# Altium schematic sheet Sd_sdio.SchDoc
size A4
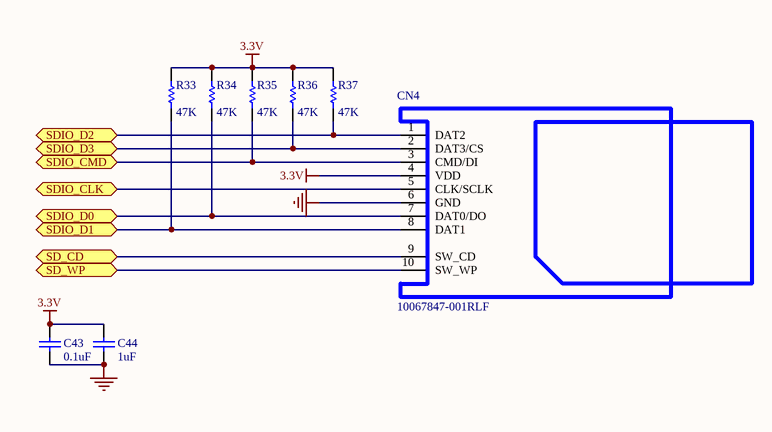
[diagram p0: Sd_sdio.SchDoc]

## Parts
C43  value 0.1uF  [CAPC2012N]  (hidden comment: Cap)
C44  value 1uF  [CAPC3216N]  (hidden comment: Cap)
CN4  10067847-001RLF  [10067847]
R33  value 47K  [RESC2012N]  (hidden comment: 1206)
R34  value 47K  [RESC2012N]  (hidden comment: 1206)
R35  value 47K  [RESC2012N]  (hidden comment: 1206)
R36  value 47K  [RESC2012N]  (hidden comment: 1206)
R37  value 47K  [RESC2012N]  (hidden comment: 1206)

## Ports
SD_CD (bidir), SD_WP (bidir), SDIO_CLK (bidir), SDIO_CMD (bidir), SDIO_D0 (bidir), SDIO_D1 (bidir), SDIO_D2 (bidir), SDIO_D3 (bidir)

## Nets
3.3V: C43.2 C44.2 CN4.4(VDD) R33.2 R34.2 R35.2 R36.2 R37.2
DGND: C43.1 C44.1 CN4.6(GND)
SD_CD: CN4.9(SW_CD) ; port SD_CD
SD_WP: CN4.10(SW_WP) ; port SD_WP
SDIO_CLK: CN4.5(CLK/SCLK) ; port SDIO_CLK
SDIO_CMD: CN4.3(CMD/DI) R35.1 ; port SDIO_CMD
SDIO_D0: CN4.7(DAT0/DO) R34.1 ; port SDIO_D0
SDIO_D1: CN4.8(DAT1) R33.1 ; port SDIO_D1
SDIO_D2: CN4.1(DAT2) R37.1 ; port SDIO_D2
SDIO_D3: CN4.2(DAT3/CS) R36.1 ; port SDIO_D3

## Library data of the parts
C43 C44 = Cap: Capacitor
CN4 = SD: SD Card Reader
R33-R37 = Res: Resistor